# Altium schematic sheet Pwr_Brd1.SchDoc
size A3; SheetNumber: 1; SheetTotal: 1
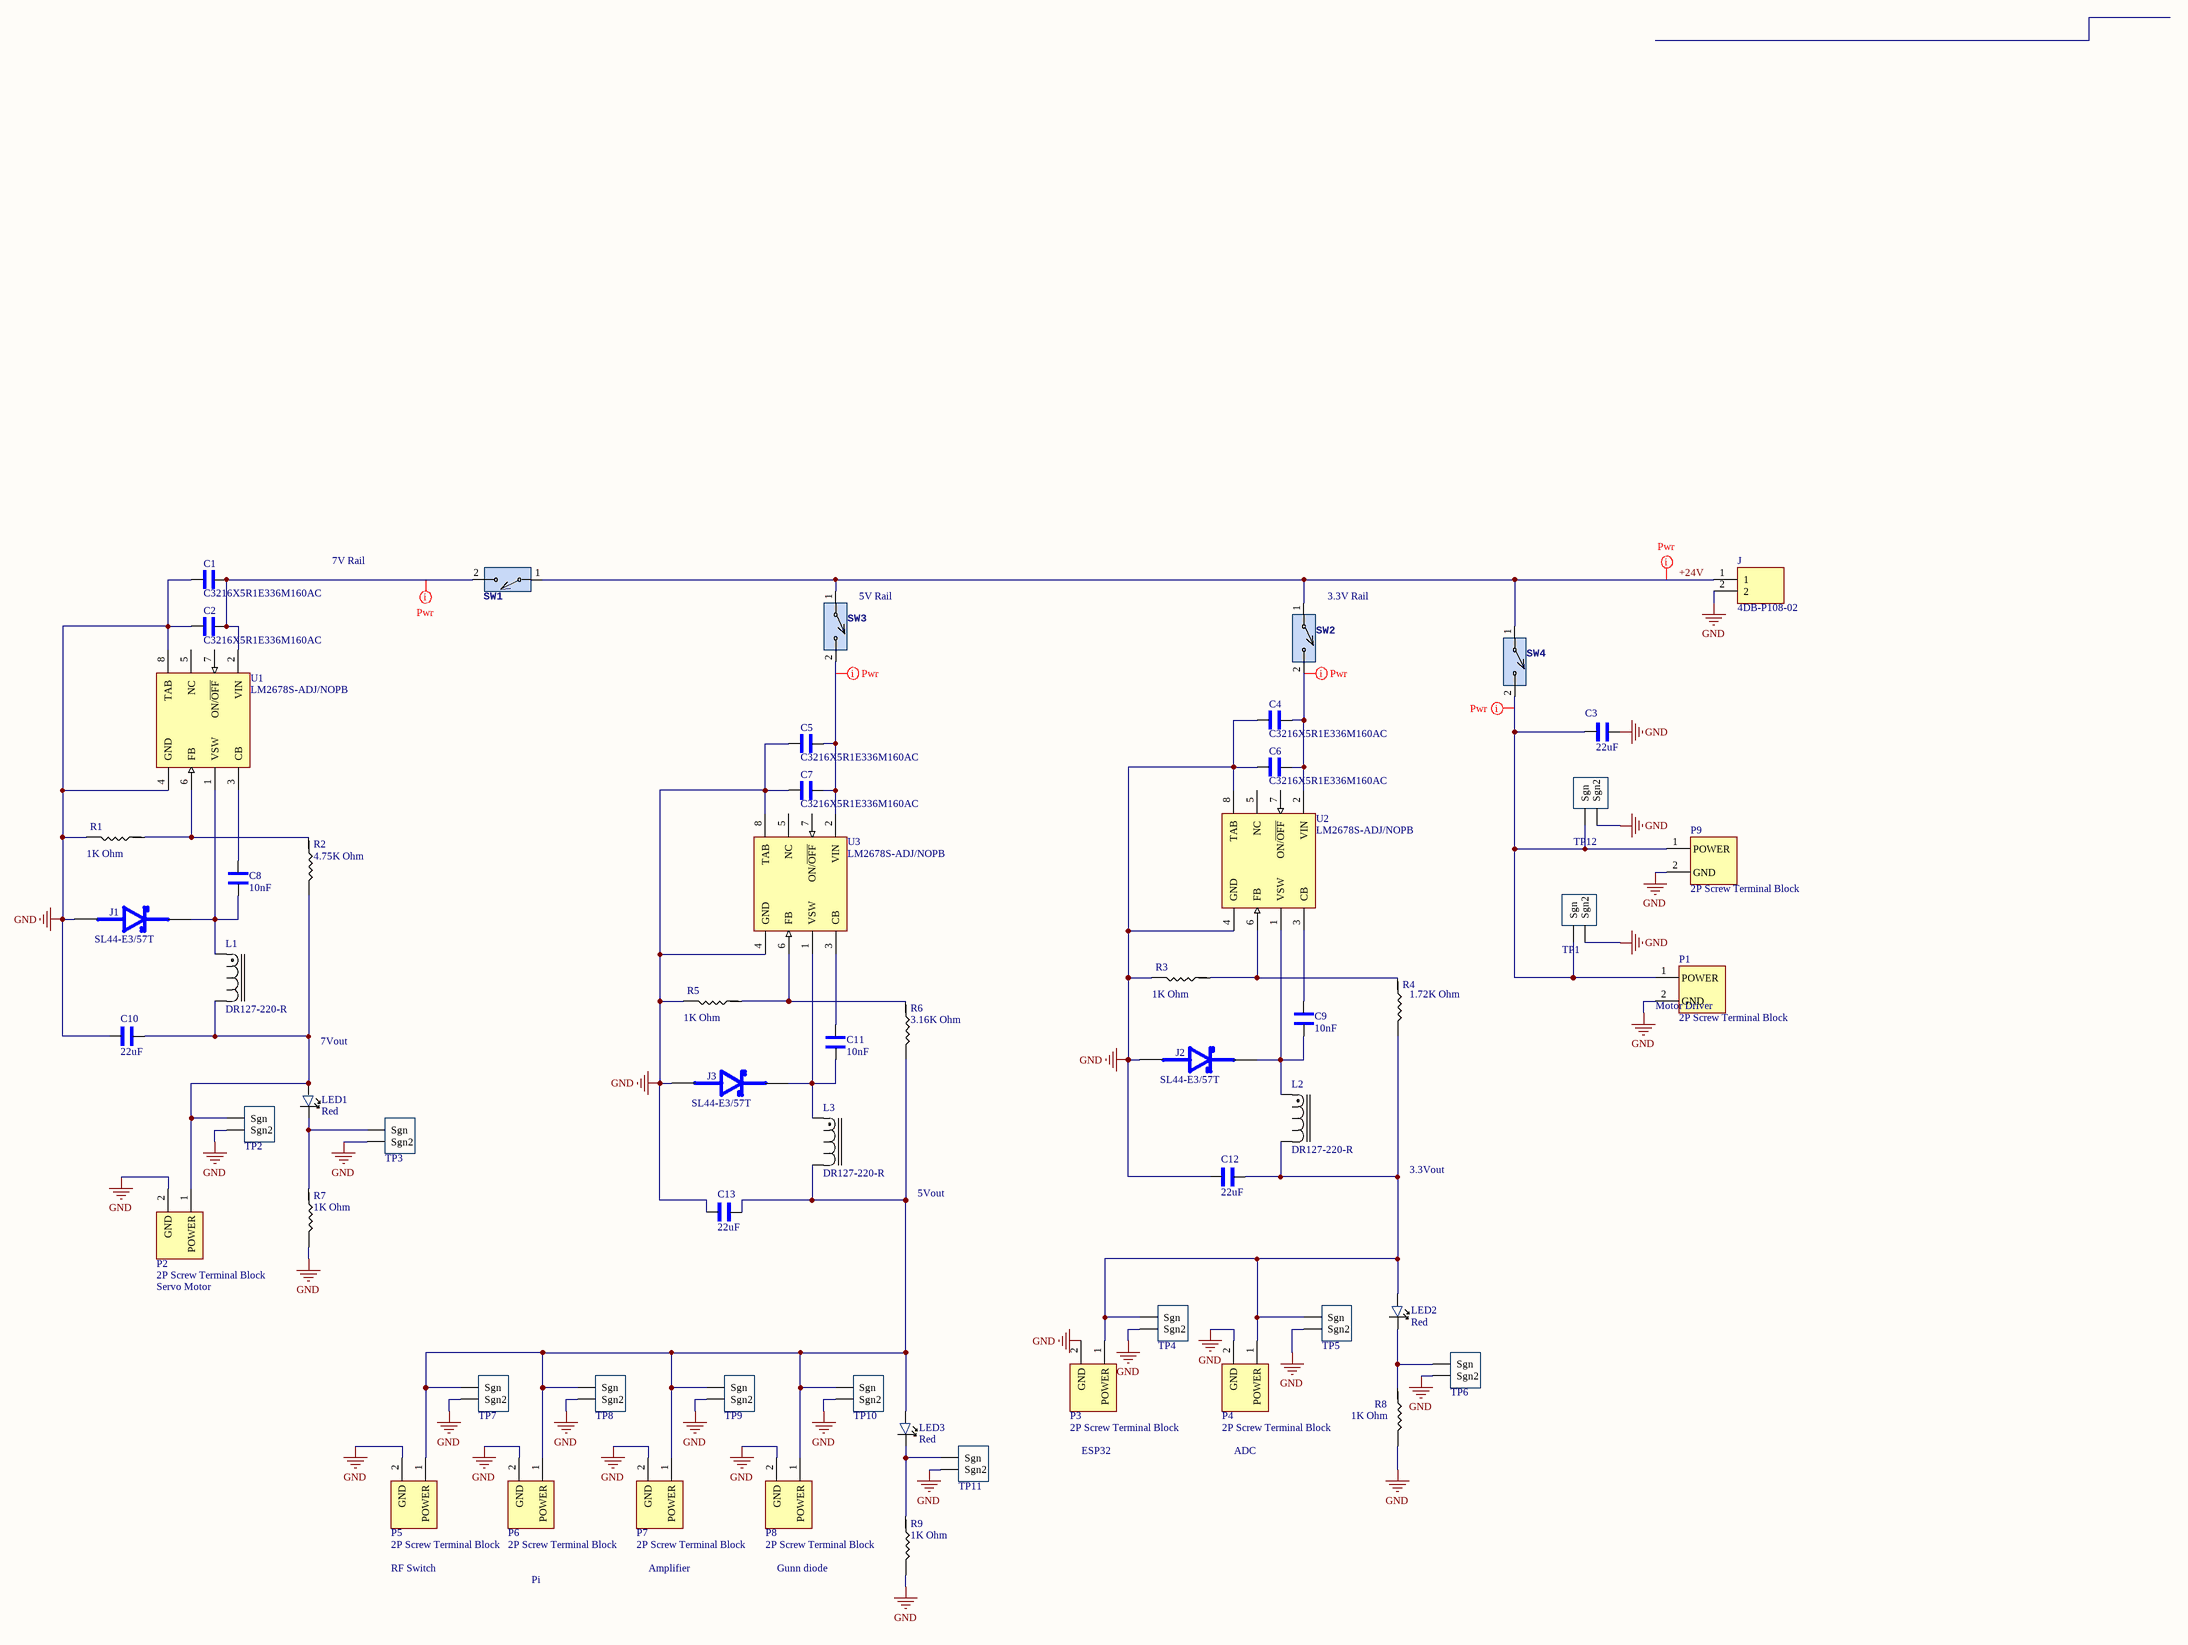
[diagram p0: Pwr_Brd1.SchDoc]

## Parts
C1  C3216X5R1E336M160AC  [CAPC3216X180N]
C2  C3216X5R1E336M160AC  [CAPC3216X180N]
C3  22uF  [1206_Passive_Capacitor]
C4  C3216X5R1E336M160AC  [CAPC3216X180N]
C5  C3216X5R1E336M160AC  [CAPC3216X180N]
C6  C3216X5R1E336M160AC  [CAPC3216X180N]
C7  C3216X5R1E336M160AC  [CAPC3216X180N]
C8  10nF  [1206_Passive_Capacitor]
C9  10nF  [1206_Passive_Capacitor]
C10  22uF  [1206_Passive_Capacitor]
C11  10nF  [1206_Passive_Capacitor]
C12  22uF  [1206_Passive_Capacitor]
C13  22uF  [1206_Passive_Capacitor]
J  4DB-P108-02  [TE_2-1437667-4]
J1  SL44-E3/57T  [DIOM7959X262N]
J2  SL44-E3/57T  [DIOM7959X262N]
J3  SL44-E3/57T  [DIOM7959X262N]
L1  DR127-220-R  [DR127]
L2  DR127-220-R  [DR127]
L3  DR127-220-R  [DR127]
LED1  Red  [LED_1206]
LED2  Red  [LED_1206]
LED3  Red  [LED_1206]
P1  2P Screw Terminal Block  [P_Terminal block 3.5mm-pitch]
P2  2P Screw Terminal Block  [P_Terminal block 3.5mm-pitch]
P3  2P Screw Terminal Block  [P_Terminal block 3.5mm-pitch]
P4  2P Screw Terminal Block  [P_Terminal block 3.5mm-pitch]
P5  2P Screw Terminal Block  [P_Terminal block 3.5mm-pitch]
P6  2P Screw Terminal Block  [P_Terminal block 3.5mm-pitch]
P7  2P Screw Terminal Block  [P_Terminal block 3.5mm-pitch]
P8  2P Screw Terminal Block  [P_Terminal block 3.5mm-pitch]
P9  2P Screw Terminal Block  [P_Terminal block 3.5mm-pitch]
R1  value 1K Ohm  [1206_Passive_Resitor]  (hidden comment: 1k)
R2  value 4.75K Ohm  [1206_Passive_Resitor]  (hidden comment: 1K)
R3  value 1K Ohm  [1206_Passive_Resitor]  (hidden comment: 1k)
R4  value 1.72K Ohm  [1206_Passive_Resitor]  (hidden comment: 1k)
R5  value 1K Ohm  [1206_Passive_Resitor]  (hidden comment: 1k)
R6  value 3.16K Ohm  [1206_Passive_Resitor]  (hidden comment: 1k)
R7  value 1K Ohm  [1206_Passive_Resitor]  (hidden comment: 1k)
R8  value 1K Ohm  [1206_Passive_Resitor]  (hidden comment: 1k)
R9  value 1K Ohm  [1206_Passive_Resitor]  (hidden comment: 1k)
SW1  SW_2Pin_100mil_Switch  [2Pin-Header-Conn]  (value not drawn)
SW2  SW_2Pin_100mil_Switch  [2Pin-Header-Conn]  (value not drawn)
SW3  SW_2Pin_100mil_Switch  [2Pin-Header-Conn]  (value not drawn)
SW4  SW_2Pin_100mil_Switch  [2Pin-Header-Conn]  (value not drawn)
TP1  10x Probe TP  [TP_Diff_Probe]  (value not drawn)
TP2  10x Probe TP  [TP_Diff_Probe]  (value not drawn)
TP3  10x Probe TP  [TP_Diff_Probe]  (value not drawn)
TP4  10x Probe TP  [TP_Diff_Probe]  (value not drawn)
TP5  10x Probe TP  [TP_Diff_Probe]  (value not drawn)
TP6  10x Probe TP  [TP_Diff_Probe]  (value not drawn)
TP7  10x Probe TP  [TP_Diff_Probe]  (value not drawn)
TP8  10x Probe TP  [TP_Diff_Probe]  (value not drawn)
TP9  10x Probe TP  [TP_Diff_Probe]  (value not drawn)
TP10  10x Probe TP  [TP_Diff_Probe]  (value not drawn)
TP11  10x Probe TP  [TP_Diff_Probe]  (value not drawn)
TP12  10x Probe TP  [TP_Diff_Probe]  (value not drawn)
U1  LM2678S-ADJ/NOPB  [KTW0007B_N]
U2  LM2678S-ADJ/NOPB  [KTW0007B_N]
U3  LM2678S-ADJ/NOPB  [KTW0007B_N]

## Nets
GND: C1.1 C2.1 C3.2 C4.1 C5.1 C6.1 C7.1 C10.1 C12.1 C13.1 J.2 J1.A J2.A J3.A P1.2(GND) P2.2(GND) P3.2(GND) P4.2(GND) P5.2(GND) P6.2(GND) P7.2(GND) P8.2(GND) P9.2(GND) R1.2 R3.2 R5.2 R7.2 R8.2 R9.2 TP1.2(Sgn2) TP2.2(Sgn2) TP3.2(Sgn2) TP4.2(Sgn2) TP5.2(Sgn2) TP6.2(Sgn2) TP7.2(Sgn2) TP8.2(Sgn2) TP9.2(Sgn2) TP10.2(Sgn2) TP11.2(Sgn2) TP12.2(Sgn2) U1.4(GND) U1.8(TAB) U2.4(GND) U2.8(TAB) U3.4(GND) U3.8(TAB)
+24V: J.1 SW1.1 SW2.1 SW3.1 SW4.1
NetC1_2: C1.2 C2.2 SW1.2 U1.2(VIN)
NetC3_1: C3.1 P1.1(POWER) P9.1(POWER) SW4.2 TP1.1(Sgn) TP12.1(Sgn)
NetC4_2: C4.2 C6.2 SW2.2 U2.2(VIN)
NetC5_2: C5.2 C7.2 SW3.2 U3.2(VIN)
NetC8_1: C8.1 J1.C L1.1 U1.1(VSW)
NetC8_2: C8.2 U1.3(CB)
NetC9_1: C9.1 J2.C L2.1 U2.1(VSW)
NetC9_2: C9.2 U2.3(CB)
NetC10_2: C10.2 L1.2 LED1.1 P2.1(POWER) R2.2 TP2.1(Sgn)
NetC11_1: C11.1 J3.C L3.1 U3.1(VSW)
NetC11_2: C11.2 U3.3(CB)
NetC12_2: C12.2 L2.2 LED2.1 P3.1(POWER) P4.1(POWER) R4.2 TP4.1(Sgn) TP5.1(Sgn)
NetC13_2: C13.2 L3.2 LED3.1 P5.1(POWER) P6.1(POWER) P7.1(POWER) P8.1(POWER) R6.2 TP7.1(Sgn) TP8.1(Sgn) TP9.1(Sgn) TP10.1(Sgn)
NetLED1_2: LED1.2 R7.1 TP3.1(Sgn)
NetLED2_2: LED2.2 R8.1 TP6.1(Sgn)
NetLED3_2: LED3.2 R9.1 TP11.1(Sgn)
NetR1_1: R1.1 R2.1 U1.6(FB)
NetR3_1: R3.1 R4.1 U2.6(FB)
NetR5_1: R5.1 R6.1 U3.6(FB)

Not connected (* = marked no-connect by the designer): U1 5(NC) 7(ON/~{OFF}); U2 5(NC) 7(ON/~{OFF}); U3 5(NC) 7(ON/~{OFF})

## Layout directives
rule Width Constraint [Pref Width = 20mil    Min Width = 10mil    Max Width = 100mil]: +24V, NetC1_2, NetC3_1, NetC4_2, NetC5_2

## Notes on the sheet
- 7V Rail
- (near SW3) 5V Rail
- (near SW2) 3.3V Rail
- (near P1) Motor Driver
- 7Vout
- 5Vout
- 3.3Vout
- Servo Motor
- ESP32
- ADC
- RF Switch
- Pi
- Amplifier
- Gunn diode

## Library data of the parts
C1 C2 C4-C7 = C3216X5R1E336M160AC: Cap Ceramic 33uF 25V X5R 20% Pad SMD 1206 85Â°C Low ESR T/R; MF: TDK Electronics; SnapEDA_Link: https://www.snapeda.com/parts/C3216X5R1E336M160AC/TDK/view-part/?ref=snap; Package: 3216 TDK; Value: *; MP: C3216X5R1E336M160AC; Check_prices: https://www.snapeda.com/parts/C3216X5R1E336M160AC/TDK/view-part/?ref=eda
C3 C10 C12 C13 = C_22uF_1206: 22uF ±10% 25V X5R 1206 Multilayer Ceramic Capacitors MLCC - SMD/SMT RoHS; MFR Part #: CL31A226KAHNNNE; Type: basic; LCSC Part#: C12891; Datasheet: https://datasheet.lcsc.com/lcsc/1811031514_Samsung-Electro-Mechanics-CL31A226KAHNNNE_C12891.pdf; Value: 22uF
C8 C9 C11 = C_10nF_1206: 10nF 50V X7R ±10% 1206 Multilayer Ceramic Capacitors MLCC - SMD/SMT ROHS; MFR Part #: CL31B105KBHNNNE; Type: Basic; Digikey Link: https://www.digikey.com/product-detail/en/C1206C105M4RACTU/399-8150-1-ND/3471873/?itemSeq=304982366; LCSC Part#: C1848; Value: 10nF
J = 4DB-P108-02: Conn; Term Strip; Barrier; 2Pole; 8.26mmPitch; SnglRow; 22-12; Series 4DB; 20A; 150V; MF: TE Connectivity; Value: *; MP: 4DB-P108-02; TE_purchase_URL: https://www.te.com/usa-en/product-2-1437667-4.html?te_bu=Cor&te_type=disp&te_campaign=seda_glo_cor-seda-global-disp-prtnr-fy19-seda-model-bom-cta_sma-317_1&elqCampaignId=32493; Package: None; Price: None; Availability: Unavailable; SnapEDA_Link: https://www.snapeda.com/parts/4DB-P108-02/TE%20Connectivity%20AMP%20Connectors/view-part/2743721/?ref=snap
J1-J3 = SL44-E3/57T: Diode Schottky 40 V 4A Surface Mount DO-214AB (SMC); MF: Vishay Semiconductor; SnapEDA_Link: https://www.snapeda.com/parts/SL44-E3/57T/Vishay/view-part/?ref=snap; Package: DO-214 Vishay; Value: *; MP: SL44-E3/57T; Check_prices: https://www.snapeda.com/parts/SL44-E3/57T/Vishay/view-part/?ref=eda
L1-L3 = DR127-220-R: Description; Manufacturer_Name: Eaton; Copyright: Copyright (C) 2025 Ultra Librarian. All rights reserved.; Manufacturer_Part_Number: DR127-220-R
LED1-LED3 = LED_RED_1206: Red 621~631nm 1206 Light Emitting Diodes (LED) RoHS; MFR Part #: 15-21/R6C-FQ1R1B/2T; Type: Extended; LCSC Part#: C93133; Datasheet: https://datasheet.lcsc.com/szlcsc/1811151241_Everlight-Elec-15-21-R6C-FQ1R1B-2T_C93133.pdf; Value: Red
P1-P9 = P_Terminal block: Green Straight pin 3.5mm  pitch; P=3.5mm  Screw terminal ROHS; MFR Part #: KF350-3.5-2P; Manufacturer: Cixi Kefa Elec; LCSC Part#: C474892; DataSheet: https://datasheet.lcsc.com/lcsc/2001160007_Cixi-Kefa-Elec-KF350-3-5-2P_C474892.pdf
R1-R9 = R_1K_1206: CHIP RESISTOR - SURFACE MOUNT 1KOHMS ±1% 1/4W 1206 ROHS; MFR Part #: RNCP1206FTD1K00CT; Digikey Link: https://www.digikey.com/product-detail/en/RNCP1206FTD1K00/RNCP1206FTD1K00CT-ND/2240675/?itemSeq=304982373; LCSC Part#: C4410; Type: Basic
SW1-SW4 = SW_2Pin_100mil_Switch: 2Pin Header; LCSC Part#: C124375; Type: Extended
TP1-TP12 = TP_Diff_Probe: Test Point 300 mil centers
U1-U3 = CMP-0069-00191-3: SIMPLE SWITCHER® High Efficiency 5A Step-Down Voltage Regulator, 7-pin TO-263, Pb-Free; Manufacturer: Texas Instruments; PackageTopMarking: NSUZXYTTE#*LM2678*S-ADJ; PowerWise: N; PackageReference: KTW0007B; CompType: Switcher; PackageDescription: TO-263, Molded, .400 x .390 x .180in Body, 7 Lead, .050in Pitch, Surface Mount; ComponentLink1Description: Datasheet URL; RoHS: Y; Code_JEDEC: MO-169-AC; PinCount: 7; ComponentLink1URL: http://www.ti.com/general/docs/lit/getliterature.tsp?genericPartNumber=LM2678&fileType=pdf